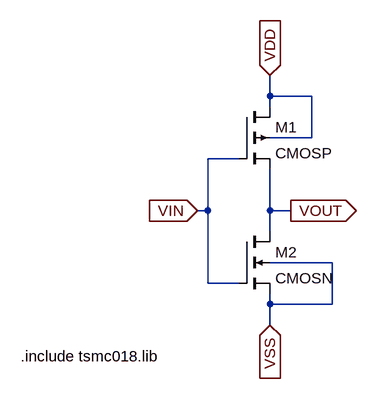
[diagram p0: schematic inverter.asc]
inverter.asc, the LTspice schematic file:
Version 4
SHEET 1 880 680
WIRE -32 -112 -32 -144
WIRE 32 -112 -32 -112
WIRE -32 -96 -32 -112
WIRE 32 -48 32 -112
WIRE 32 -48 -32 -48
WIRE -80 -16 -128 -16
WIRE -128 64 -128 -16
WIRE -128 64 -144 64
WIRE -32 64 -32 0
WIRE 0 64 -32 64
WIRE -32 96 -32 64
WIRE 64 144 -32 144
WIRE -128 176 -128 64
WIRE -80 176 -128 176
WIRE -32 208 -32 192
WIRE 64 208 64 144
WIRE 64 208 -32 208
WIRE -32 240 -32 208
FLAG -32 -144 VDD
IOPIN -32 -144 In
FLAG -144 64 VIN
IOPIN -144 64 In
FLAG 0 64 VOUT
IOPIN 0 64 Out
FLAG -32 240 VSS
IOPIN -32 240 In
SYMBOL nmos4 -80 96 R0
SYMATTR InstName M2
SYMATTR Value CMOSN
SYMATTR Value2 l=0.18u w=1u
SYMBOL pmos4 -80 -96 R0
SYMATTR InstName M1
SYMATTR Value CMOSP
SYMATTR Value2 l=0.18u w=2u
TEXT -416 288 Left 2 !.include tsmc018.lib

The netlist it stands for:
* inverter.asc
M2 VOUT VIN VSS VSS CMOSN l=0.18u w=1u
M1 VDD VIN VOUT VDD CMOSP l=0.18u w=2u
.model NMOS NMOS
.model PMOS PMOS
.lib standard.mos
.include tsmc018.lib
.backanno
.end